# Altium schematic sheet Sheet1.schdoc
size A4
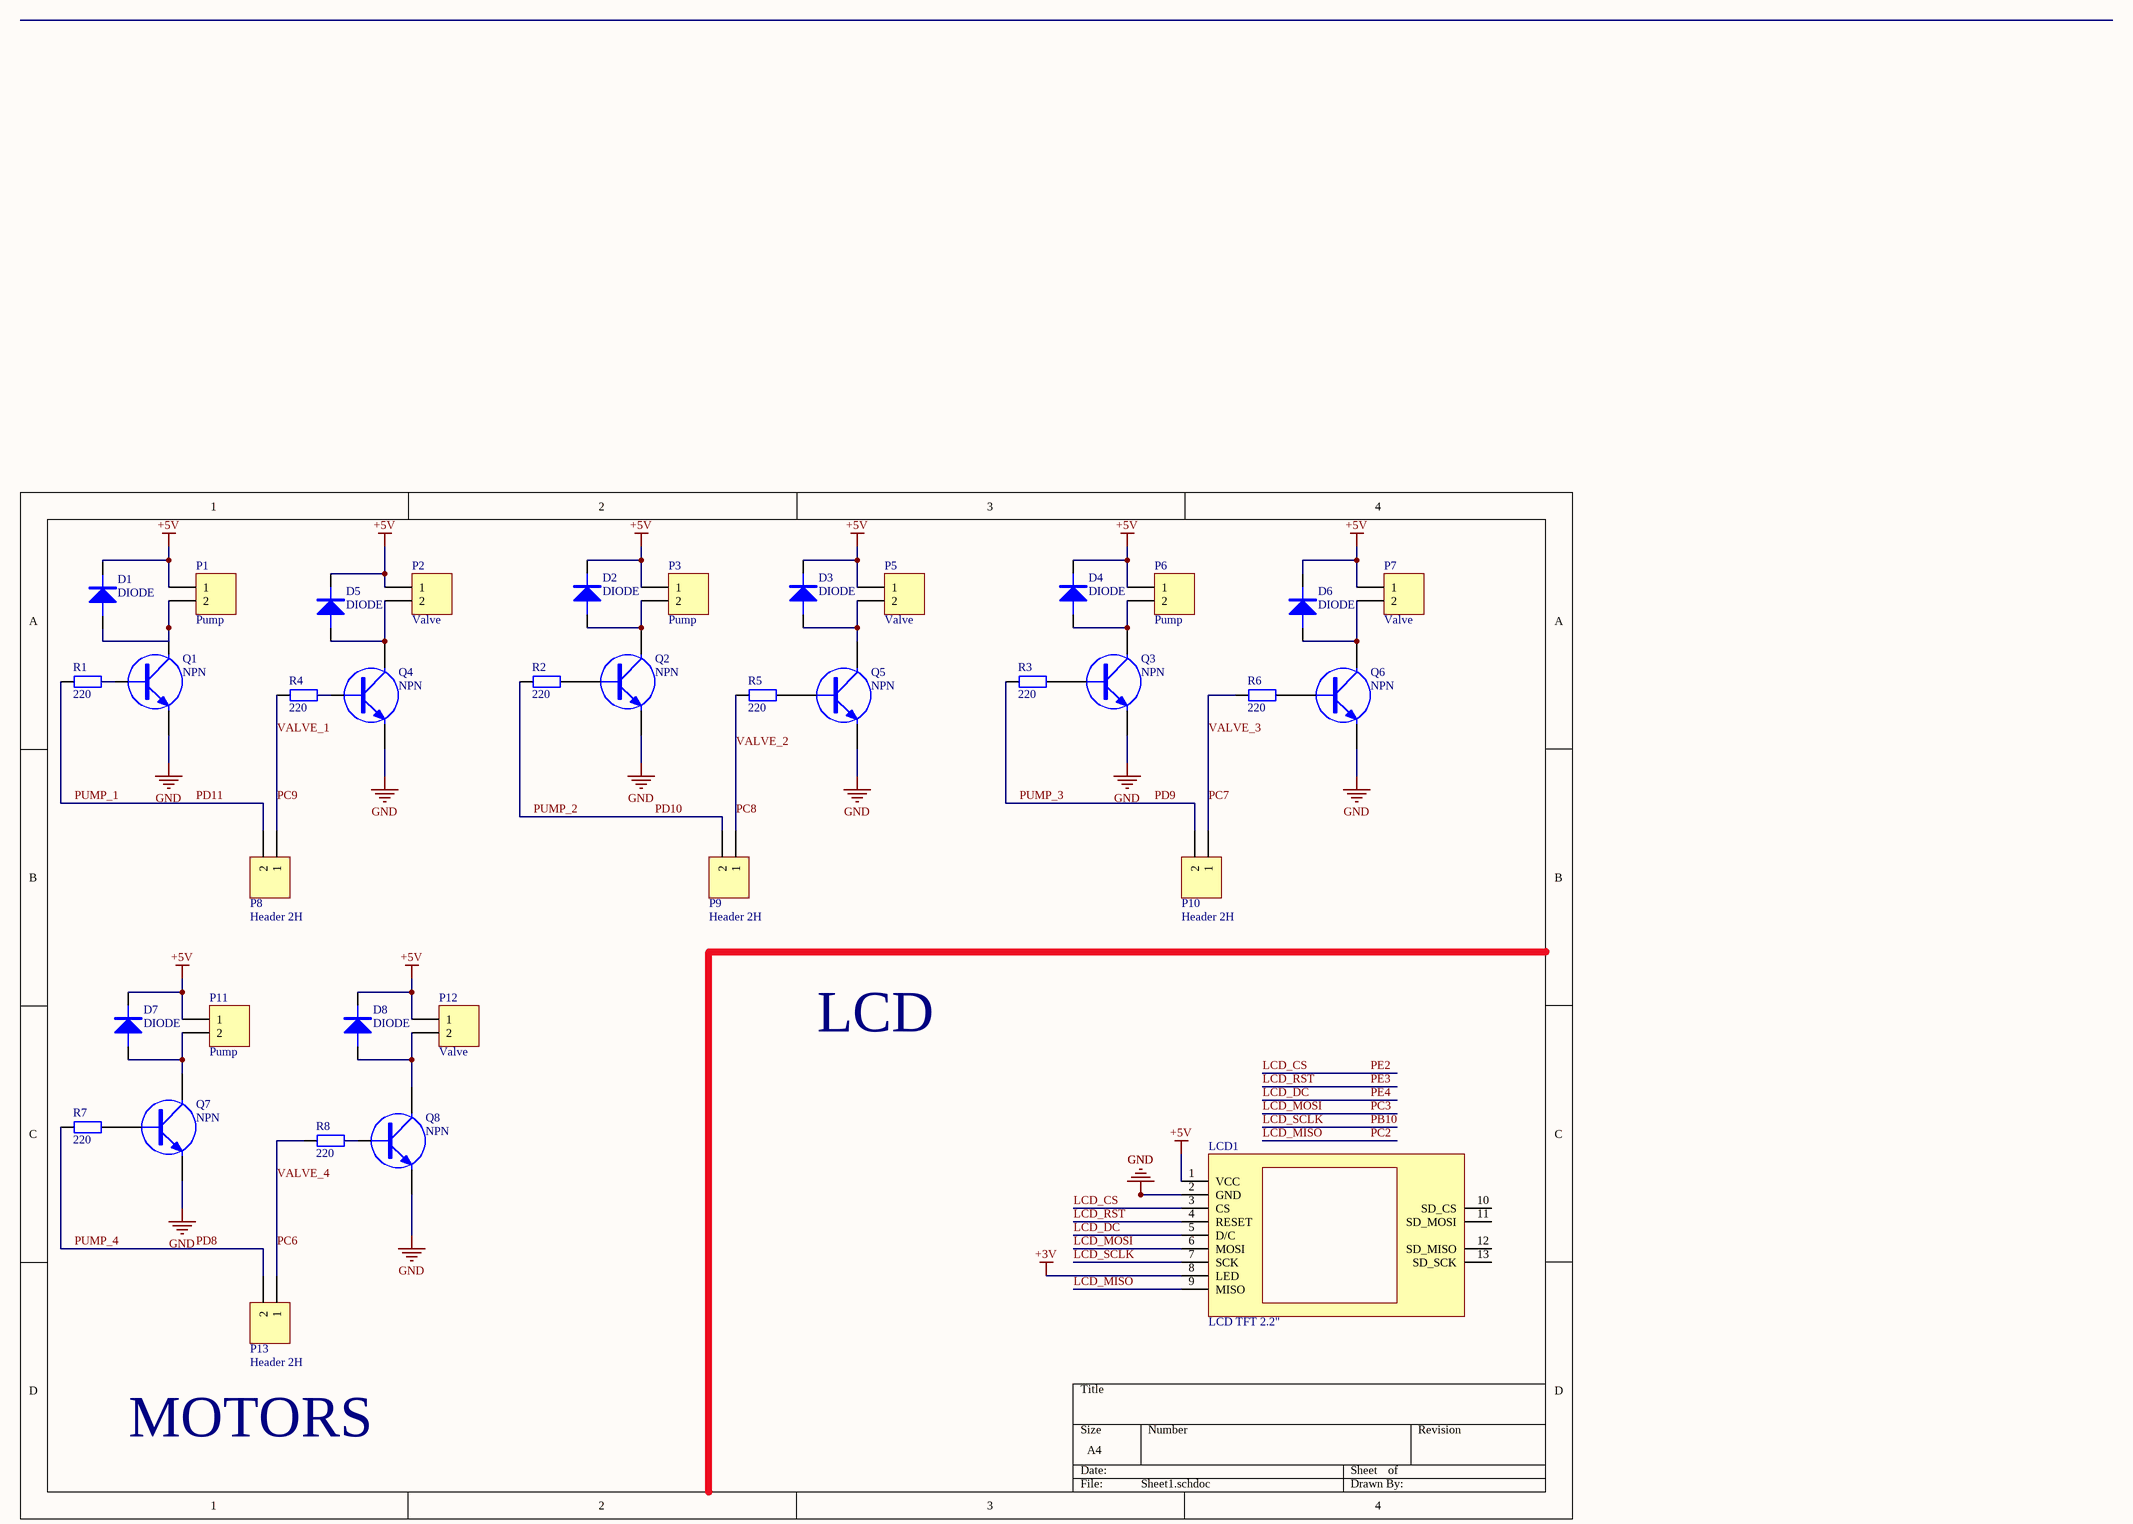
[diagram p0: Sheet1.schdoc]

## Parts
D1  DIODE  [DIODE SMA]
D2  DIODE  [DIODE SMA]
D3  DIODE  [DIODE SMA]
D4  DIODE  [DIODE SMA]
D5  DIODE  [DIODE SMA]
D6  DIODE  [DIODE SMA]
D7  DIODE  [DIODE SMA]
D8  DIODE  [DIODE SMA]
LCD1  LCD TFT 2.2"  [LCD TFT 2.2"]
P1  Pump  [HDR1X2]
P2  Valve  [HDR1X2]
P3  Pump  [HDR1X2]
P5  Valve  [HDR1X2]
P6  Pump  [HDR1X2]
P7  Valve  [HDR1X2]
P8  Header 2H  [HDR1X2]
P9  Header 2H  [HDR1X2]
P10  Header 2H  [HDR1X2]
P11  Pump  [HDR1X2]
P12  Valve  [HDR1X2]
P13  Header 2H  [HDR1X2]
Q1  NPN  [SOT23 - 3PIN]
Q2  NPN  [SOT23 - 3PIN]
Q3  NPN  [SOT23 - 3PIN]
Q4  NPN  [SOT23 - 3PIN]
Q5  NPN  [SOT23 - 3PIN]
Q6  NPN  [SOT23 - 3PIN]
Q7  NPN  [SOT23 - 3PIN]
Q8  NPN  [SOT23 - 3PIN]
R1  220  [0805 RESISTOR]
R2  220  [0805 RESISTOR]
R3  220  [0805 RESISTOR]
R4  220  [0805 RESISTOR]
R5  220  [0805 RESISTOR]
R6  220  [0805 RESISTOR]
R7  220  [0805 RESISTOR]
R8  220  [0805 RESISTOR]

## Nets
+3V: LCD1.8(LED)
+5V: D1.2 D2.2 D3.2 D4.2 D5.2 D6.2 D7.2 D8.2 LCD1.1(VCC) P1.1 P2.1 P3.1 P5.1 P6.1 P7.1 P11.1 P12.1
GND: LCD1.2(GND) Q1.1(E) Q2.1(E) Q3.1(E) Q4.1(E) Q5.1(E) Q6.1(E) Q7.1(E) Q8.1(E)
LCD_CS: LCD1.3(CS)  [also labelled PE2]
LCD_DC: LCD1.5(D/C)  [also labelled PE4]
LCD_MISO: LCD1.9(MISO)  [also labelled PC2]
LCD_MOSI: LCD1.6(MOSI)  [also labelled PC3]
LCD_RST: LCD1.4(RESET)  [also labelled PE3]
LCD_SCLK: LCD1.7(SCK)  [also labelled PB10]
PC6: P13.1 R8.2  [also labelled VALVE_4]
PC7: P10.1 R6.2  [also labelled VALVE_3]
PC8: P9.1 R5.2  [also labelled VALVE_2]
PC9: P8.1 R4.2  [also labelled VALVE_1]
PD8: P13.2 R7.2  [also labelled PUMP_4]
PD9: P10.2 R3.2  [also labelled PUMP_3]
PD10: P9.2 R2.2  [also labelled PUMP_2]
PD11: P8.2 R1.2  [also labelled PUMP_1]
NetD1_1: D1.1 P1.2 Q1.2(C)
NetD2_1: D2.1 P3.2 Q2.2(C)
NetD3_1: D3.1 P5.2 Q5.2(C)
NetD4_1: D4.1 P6.2 Q3.2(C)
NetD5_1: D5.1 P2.2 Q4.2(C)
NetD6_1: D6.1 P7.2 Q6.2(C)
NetD7_1: D7.1 P11.2 Q7.2(C)
NetD8_1: D8.1 P12.2 Q8.2(C)
NetQ1_3: Q1.3(B) R1.1
NetQ2_3: Q2.3(B) R2.1
NetQ3_3: Q3.3(B) R3.1
NetQ4_3: Q4.3(B) R4.1
NetQ5_3: Q5.3(B) R5.1
NetQ6_3: Q6.3(B) R6.1
NetQ7_3: Q7.3(B) R7.1
NetQ8_3: Q8.3(B) R8.1

Not connected (* = marked no-connect by the designer): LCD1 10(SD_CS) 11(SD_MOSI) 12(SD_MISO) 13(SD_SCK)

## Notes on the sheet
- LCD
- MOTORS

## Library data of the parts
P1-P3 P5-P7 P11 P12 = Header 2H: LatestRevisionDate: 17-Jul-2002; LatestRevisionNote: Re-released for DXP Platform.; Publisher: Altium Limited
R1-R8 = RESISTOR: Value: R1/4W - 1K
P8-P10 P13 = Header 2H: LatestRevisionDate: 17-Jul-2002; LatestRevisionNote: Re-released for DXP Platform.; Publisher: Altium Limited